# EAGLE schematic LTM8055 AddonBoard v1.1 (EAGLE 6.4)
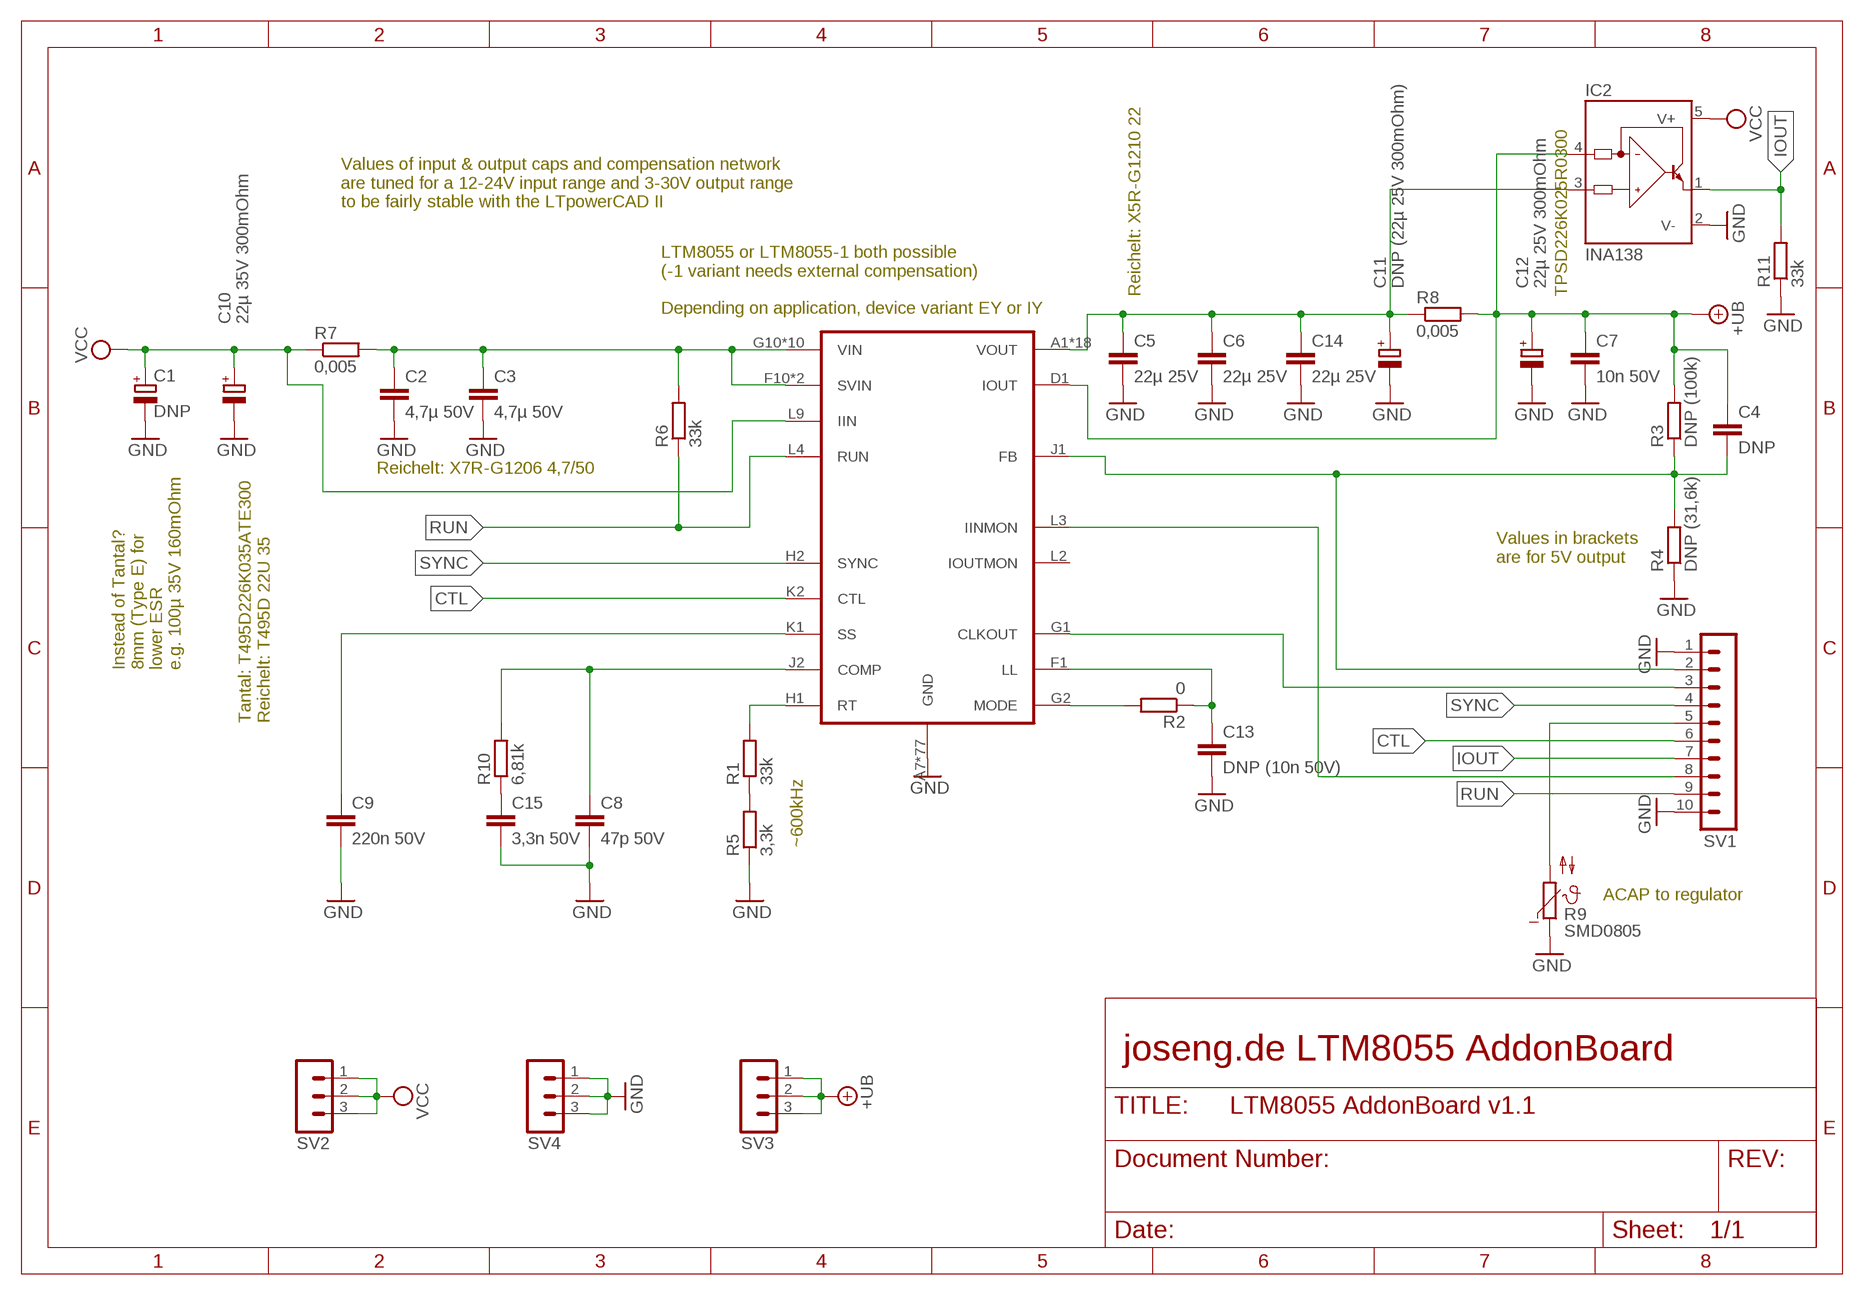
[diagram p0: schematic, sheet 1]

## Parts
C1  DNP  CPOL-EUE  [PANASONIC_E]
C2  4,7µ 50V  C-EUC1206  [C1206]
C3  4,7µ 50V  C-EUC1206  [C1206]
C4  DNP  C-EUC0805  [C0805]
C5  22µ 25V  C-EUC1210  [C1210]
C6  22µ 25V  C-EUC1210  [C1210]
C7  10n 50V  C-EUC0805  [C0805]
C8  47p 50V  C-EUC0805  [C0805]
C9  220n 50V  C-EUC0805  [C0805]
C10  22µ 35V 300mOhm  CPOL-EUD/7343-31R  [D/7343-31R]
C11  DNP (22µ 25V 300mOhm)  CPOL-EUD/7343-31R  [D/7343-31R]
C12  22µ 25V 300mOhm  CPOL-EUD/7343-31R  [D/7343-31R]
C13  DNP (10n 50V)  C-EUC0805  [C0805]
C14  22µ 25V  C-EUC1210  [C1210]
C15  3,3n 50V  C-EUC0805  [C0805]
IC1  LTM8055-1  [BGA121_1.27_15X15MM]
IC2  INA138  [SOT23-5]
R1  33k  R-EU_R0805  [R0805]
R2  0  R-EU_R0805  [R0805]
R3  DNP (100k)  R-EU_R0805  [R0805]
R4  DNP (31,6k)  R-EU_R0805  [R0805]
R5  3,3k  R-EU_R0805  [R0805]
R6  33k  R-EU_R0805  [R0805]
R7  0,005  R-EU_R2512  [R2512]
R8  0,005  R-EU_R2512  [R2512]
R9  SMD0805  [R0805]
R10  6,81k  R-EU_R0805  [R0805]
R11  33k  R-EU_R0805  [R0805]
SV1  MA10-1  [MA10-1]
SV2  MA03-1  [MA03-1]
SV3  MA03-1  [MA03-1]
SV4  MA03-1  [MA03-1]

## Nets
+UB: C4.1 C7.1 C12.+ IC1.D1(IOUT) IC2.4(IN-) R3.2 R8.2 SV3.1 SV3.2 SV3.3
CTL: IC1.K2(CTL) SV1.6
GND: C1.- C2.2 C3.2 C5.2 C6.2 C7.2 C8.2 C9.2 C10.- C11.- C12.- C13.2 C14.2 C15.2 IC1.A7(GND) IC1.A8(GND) IC1.A9(GND) IC1.A10(GND) IC1.A11(GND) IC1.B7(GND) IC1.B8(GND) IC1.B9(GND) IC1.B10(GND) IC1.B11(GND) IC1.C7(GND) IC1.C8(GND) IC1.C9(GND) IC1.C10(GND) IC1.C11(GND) IC1.D2(GND) IC1.D3(GND) IC1.D4(GND) IC1.D5(GND) IC1.D6(GND) IC1.D7(GND) IC1.D8(GND) IC1.D9(GND) IC1.D10(GND) IC1.D11(GND) IC1.E1(GND) IC1.E2(GND) IC1.E3(GND) IC1.E4(GND) IC1.E5(GND) IC1.E6(GND) IC1.E7(GND) IC1.E8(GND) IC1.E9(GND) IC1.E10(GND) IC1.E11(GND) IC1.F2(GND) IC1.F3(GND) IC1.F4(GND) IC1.F5(GND) IC1.F6(GND) IC1.F7(GND) IC1.F8(GND) IC1.F9(GND) IC1.G3(GND) IC1.G4(GND) IC1.G5(GND) IC1.G6(GND) IC1.G7(GND) IC1.G8(GND) IC1.G9(GND) IC1.H3(GND) IC1.H4(GND) IC1.H5(GND) IC1.H6(GND) IC1.H7(GND) IC1.H8(GND) IC1.H9(GND) IC1.J3(GND) IC1.J4(GND) IC1.J5(GND) IC1.J6(GND) IC1.J7(GND) IC1.J8(GND) IC1.J9(GND) IC1.K3(GND) IC1.K4(GND) IC1.K5(GND) IC1.K6(GND) IC1.K7(GND) IC1.K8(GND) IC1.K9(GND) IC1.L1(GND) IC1.L5(GND) IC1.L6(GND) IC1.L7(GND) IC1.L8(GND) IC2.2(V-) R4.1 R5.1 R9.1 R11.1 SV1.1 SV1.10 SV4.1 SV4.2 SV4.3
IOUT: IC2.1(OUT) R11.2 SV1.7
N$1: C13.1 IC1.F1(LL) R2.1
N$2: IC1.G2(MODE) R2.2
N$3: IC1.G1(CLKOUT) SV1.3
N$4: C9.1 IC1.K1(SS)
N$5: C4.2 IC1.J1(FB) R3.1 R4.2 SV1.2
N$7: IC1.L3(IINMON) SV1.8
N$8: IC1.H1(RT) R1.2
N$9: C2.1 C3.1 IC1.F10(SVIN) IC1.F11(SVIN) IC1.G10(VIN) IC1.G11(VIN) IC1.H10(VIN) IC1.H11(VIN) IC1.J10(VIN) IC1.J11(VIN) IC1.K10(VIN) IC1.K11(VIN) IC1.L10(VIN) IC1.L11(VIN) R6.2 R7.2
N$10: R1.1 R5.2
N$11: C8.1 IC1.J2(COMP) R10.2
N$12: R9.2 SV1.5
N$13: C15.1 R10.1
N$14: C5.1 C6.1 C11.+ C14.1 IC1.A1(VOUT) IC1.A2(VOUT) IC1.A3(VOUT) IC1.A4(VOUT) IC1.A5(VOUT) IC1.A6(VOUT) IC1.B1(VOUT) IC1.B2(VOUT) IC1.B3(VOUT) IC1.B4(VOUT) IC1.B5(VOUT) IC1.B6(VOUT) IC1.C1(VOUT) IC1.C2(VOUT) IC1.C3(VOUT) IC1.C4(VOUT) IC1.C5(VOUT) IC1.C6(VOUT) IC2.3(IN+) R8.1
RUN: IC1.L4(RUN) R6.1 SV1.9
SYNC: IC1.H2(SYNC) SV1.4
VCC: C1.+ C10.+ IC1.L9(IIN) IC2.5(V+) R7.1 SV2.1 SV2.2 SV2.3
Unconnected: IC1.L2(IOUTMON)

## Notes on the sheet
- Values of input & output caps and compensation network
  are tuned for a 12-24V input range and 3-30V output range
  to be fairly stable with the LTpowerCAD II
- Reichelt: X5R-G1210 22 | TPSD226K025R0300
- LTM8055 or LTM8055-1 both possible
  (-1 variant needs external compensation)
  
  Depending on application, device variant EY or IY
- Reichelt: X7R-G1206 4,7/50
- Values in brackets
  are for 5V output
- Instead of Tantal?
  8mm (Type E) for
  lower ESR
  e.g. 100µ 35V 160mOhm
- Tantal: T495D226K035ATE300
  Reichelt: T495D 22U 35
- ~600kHz
- ACAP to regulator
- joseng.de LTM8055 AddonBoard

## Library data of the parts
C1 C10-C12 = rcl:CPOL-EU: POLARIZED CAPACITOR, European symbol
C2-C9 C13-C15 = rcl:C-EU: CAPACITOR, European symbol
IC1 = linear-technology:LTM8055: LTM8055/LTM8055-1 36Vin, 8.5A Buck-Boost μModule Regulator FEATURES - Complete Buck-Boost Switch Mode Power Supply - VOUT Equal, Greater, Less Than VIN - Wide Input Voltage Range: 5V to 36V - 12V/3A Output from 6VIN - 12V/6A Output from 12VIN - 12V/8.5A Output from 24VIN - Up to 97.5% Efficient - Adjustable Input and Output Average Current Limits - Input and Output Current Monitors - Parallelable for Increased Output Current - Wide Output Voltage Range: 1.2V to 36V - Selectable Switching Frequency: 100kHz to 800kHz - Synchronization from 200kHz to 700kHz - External Compensation (LTM8055-1) - 15mm × 15mm × 4.92mm BGA Package APPLICATIONS - High Power Battery-Operated Devices - Industrial Control - Solar Powered Voltage Regulator - Solar Powered Battery Charging
IC2 = burr-brown:INA138: High-Side Measurement Current Shunt Monitor; MF: TEXAS INSTRUMENTS; MPN: INA138NA/250; OC_FARNELL: 1564888; OC_NEWARK: 80K5906
R1-R8 R10 R11 = rcl:R-EU_: RESISTOR, European symbol
R9 = ptc-ntc:SMD0805: EPCOS NTC 0805
SV1 = con-lstb:MA10-1: PIN HEADER; OC_FARNELL: unknown; OC_NEWARK: unknown
SV2-SV4 = con-lstb:MA03-1: PIN HEADER; OC_FARNELL: unknown; OC_NEWARK: unknown